# Altium schematic sheet 30-277 - DriveHUB - CV Card DCDC Module.SchDoc: IPM2 Smart Bob - 2Ch CC
size A1; Date: 08/02/22; Engineer: AJC; DocumentNumber: 34-413; Revision: A; SheetNumber: 1; SheetTotal: 1; Manager: AJC
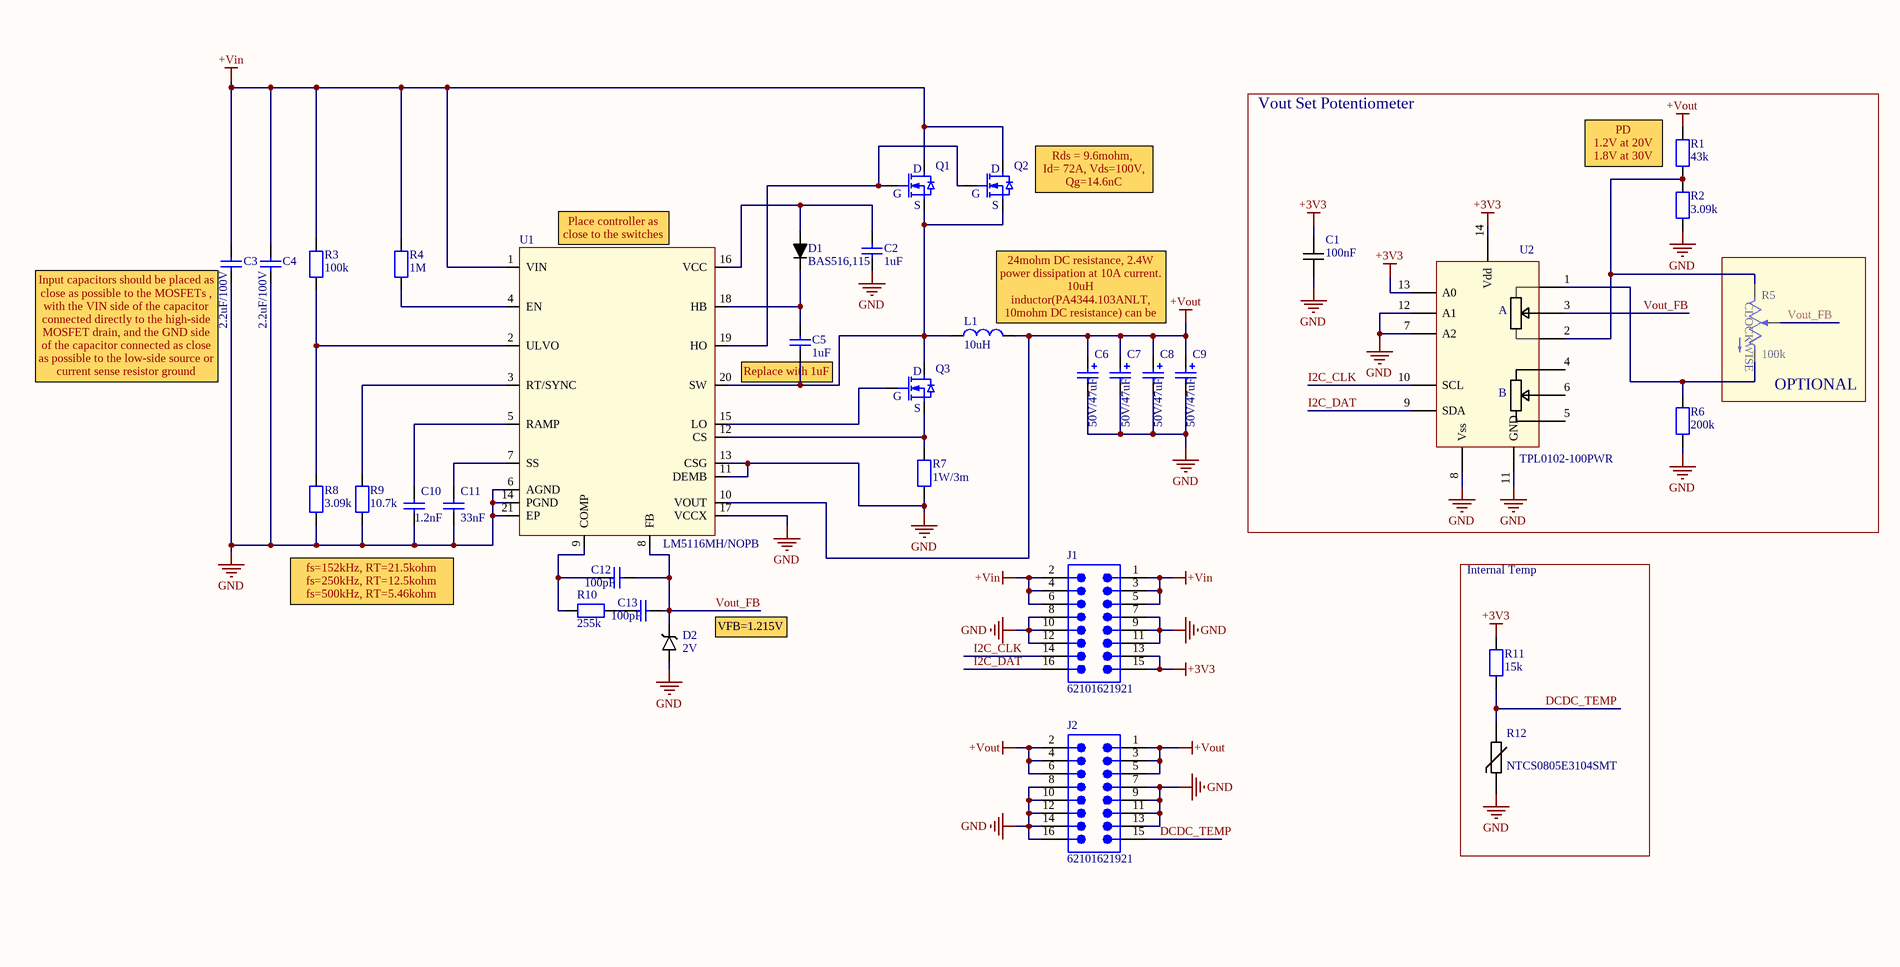
[diagram p0: 30-277 - DriveHUB - CV Card DCDC Module.SchDoc, left]
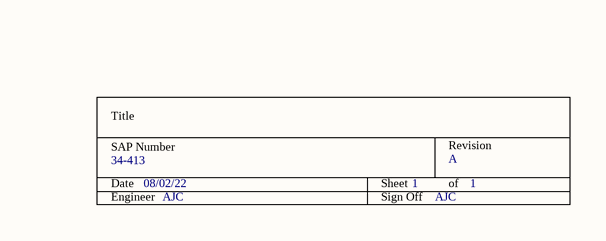
[diagram p1: 30-277 - DriveHUB - CV Card DCDC Module.SchDoc, right]

## Parts
?  Drawn By: AJC  Document Number: 34-413  Revision Number: A  Total Sheets: 1  Design Date: 08/02/22  (hidden comment: Title Block Standard_GDS)  (graphical)
C1  100nF  [SMD_C(0603)]
C2  1uF  [SMD_C(0805)]
C3  2.2uF/100V  [SMD_C(1210)]
C4  2.2uF/100V  [SMD_C(1210)]
C5  1uF  [SMD_C(0805)]
C6  50V/47uF  [CAPAE7866X54M]
C7  50V/47uF  [CAPAE7866X54M]
C8  50V/47uF  [CAPAE7866X54M]
C9  50V/47uF  [CAPAE7866X54M]
C10  1.2nF  [SMD_C(0603)]
C11  33nF  [SMD_C(0603)]
C12  100pF  [SMD_C(0603)]
C13  100pF  [SMD_C(0603)]
D1  BAS516,115  [SOD523]
D2  2V  [SOD123]
J1  62101621921  [62101621921]
J2  62101621921  [62101621921]
L1  10uH  [Ind_PA4344.223ANLT]
Q1  BSC0805LSATMA1  [TDSON-8]  (value not drawn)
Q2  BSC0805LSATMA1  [TDSON-8]  (value not drawn)
Q3  BSC0805LSATMA1  [TDSON-8]  (value not drawn)
R1  43k  [SMD_R(0603)]
R2  3.09k  [SMD_R(0603)]
R3  100k  [SMD_R(0603)]
R4  1M  [SMD_R(0603)]
R5  100k  [TRIM_3361P-1-104GLF]
R6  200k  [SMD_R(0603)]
R7  1W/3m  [SMD_R(2512)]
R8  3.09k  [SMD_R(0603)]
R9  10.7k  [SMD_R(0603)]
R10  255k  [SMD_R(0603)]
R11  15k  [SMD_R(0603)]
R12  NTCS0805E3104SMT  [SMD_R(0805)]
U1  LM5116MH/NOPB  [HTSSOP-20]
U2  TPL0102-100PWR  [SOP65P640X120-14N]

## Blocks framed on the sheet
Vout Set Potentiometer: C1 R1 R2 R6 U2
OPTIONAL: R5
Internal Temp: R11 R12

## Nets
+3V3: C1.2 J1.13 J1.15 R11.2 U2.13(A0) U2.14(Vdd)
+Vin: C3.2 C4.2 J1.1 J1.2 J1.3 J1.4 J1.5 J1.6 Q1.D Q2.D R3.2 R4.2 U1.1(VIN)
+Vout: C6.1 C7.1 C8.1 C9.1 J2.1 J2.2 J2.3 J2.4 J2.5 J2.6 L1.2 R1.2 U1.10(VOUT)
GND: C1.1 C2.1 C3.1 C4.1 C6.2 C7.2 C8.2 C9.2 C10.1 C11.1 D2.A J1.7 J1.8 J1.9 J1.10 J1.11 J1.12 J2.7 J2.8 J2.9 J2.10 J2.11 J2.12 J2.13 J2.14 J2.16 R2.1 R6.1 R7.1 R8.1 R9.1 R12.2 U1.6(AGND) U1.11(DEMB) U1.13(CSG) U1.14(PGND) U1.17(VCCX) U1.21(EP) U2.7(A2) U2.8(Vss) U2.11(GND) U2.12(A1)
DCDC_TEMP: J2.15 R11.1 R12.1
I2C_CLK: J1.14 U2.10(SCL)
I2C_DAT: J1.16 U2.9(SDA)
Vout_FB: C12.2 C13.2 D2.C R5.2(WIPER) U1.8(FB) U2.3
NetC2_2: C2.2 D1.A U1.16(VCC)
NetC5_1: C5.1 L1.1 Q1.S Q2.S Q3.D U1.20(SW)
NetC5_2: C5.2 D1.C U1.18(HB)
NetC10_2: C10.2 U1.5(RAMP)
NetC11_2: C11.2 U1.7(SS)
NetC12_1: C12.1 R10.1 U1.9(COMP)
NetC13_1: C13.1 R10.2
NetQ1_G: Q1.G Q2.G U1.19(HO)
NetQ3_G: Q3.G U1.15(LO)
NetQ3_S: Q3.S R7.2 U1.12(CS)
NetR1_1: R1.1 R2.2 R5.1(CCW) U2.2
NetR3_1: R3.1 R8.2 U1.2(ULVO)
NetR4_1: R4.1 U1.4(EN)
NetR5_3: R5.3(CW) R6.2 U2.1
NetR9_2: R9.2 U1.3(RT/SYNC)

Not connected (* = marked no-connect by the designer): U2 4 5 6

## Notes on the sheet
- PD
  1.2V at 20V
  1.8V at 30V
- (near U1) Place controller as close to the switches
- (near Q2) Rds = 9.6mohm,
  Id= 72A, Vds=100V,
  Qg=14.6nC
- (near C3) Input capacitors should be placed as close as possible to the MOSFETs , with the VIN side of the capacitor connected directly to the high-side MOSFET drain, and the GND side of the capacitor connected as close as possible to the low-side source or current sense resistor ground connection.
- (near C5) Replace with 1uF
- (near L1) 24mohm DC resistance, 2.4W power dissipation at 10A current.
  10uH inductor(PA4344.103ANLT, 10mohm DC resistance) can be used at 500kHz fsw
- fs=152kHz, RT=21.5kohm
  fs=250kHz, RT=12.5kohm
  fs=500kHz, RT=5.46kohm
- VFB=1.215V
- (in symbol 3361P-1-104GLF) CLOCKWISE
- (in symbol Title Block Standard_GDS) Title; SAP Number; Revision; Date; Sheet; of; Engineer; Sign Off
- (in symbol TPL0102-100RUCR) A; B

## Library data of the parts
C1 = 100nF 50V 0603 X7R: Manufacturer: Yageo; Manufacturer Part Number: CC0603KRX7R9BB104; Value: 100nF; Supplier: mouser; Supplier Part Number: 603-CC603KRX7R9BB104
C2 C5 = 1uF ±10% 50V: Manufacturer: Yageo; Manufacturer Part Number: CC0805KKX5R9BB105; Value: 1uF; Supplier: mouser; Supplier Part Number: 603-CC0805KKX5R9BB105; Price: 0.26
C3 C4 = C1210C225K1RACTU: 2.2 uF ± 10% 100V; Manufacturer: KEMET; Value: 2.2uF/100V; Manufacturer Part Number: C1210C225K1RACTU; Supplier: mouser; Supplier Part Number: 80-C1210C225K1R; Price: 0.96
C6-C9 = EMZR500ARA470MF61G: Aluminium Electrolytic Capacitors - SMD 50V 47uF 2000Hrs 20% ESR=680mOhms; Manufacturer: United Chemi-Con; Manufacturer Part Number: EMZR500ARA470MF61G; Supplier: mouser; Supplier Part Number: 661-EMZR500ARA470MF6; Value: 50V/47uF
C10 = 1.2nF ± 5% 50V: Manufacturer: Yageo; Manufacturer Part Number: CC0603JRX7R9BB122; Value: 1.2nF; Supplier: mouser; Supplier Part Number: 603-CC0603JRX7R9BB122
C11 = 33nF ± 10% 50V: Manufacturer: Yageo; Manufacturer Part Number: CC0603JRX7R9BB333; Value: 33nF; Supplier: mouser; Supplier Part Number: 603-CC0603JRX7R9BB333
C12 C13 = 100pF ± 5% 50V: Manufacturer: Yageo; Manufacturer Part Number: CC0603JRNPO9BN101; Value: 100pF; Supplier: mouser; Supplier Part Number: 603-CC0603JRNPO9BN101; Price: 0.1
D1 = BAS516,115: Diodes - General Purpose, Power, Switching; Manufacturer: Nexperia; PackageReference: BAS516,115; Manufacturer Part Number: BAS516,115; Value: BAS516,115; Supplier: mouser; Supplier Part Number: 771-BAS516-T/R
D2 = SZMMSZ4679T1G: Zener Diodes 500MW 2V; Manufacturer: onsemi; Manufacturer Part Number: SZMMSZ4679T1G; Value: 2V; Supplier: mouser; Supplier Part Number: 863-SZMMSZ4679T1G
J1 J2 = 62101621921: WR-PHD Pin Header, SMT, Vertical, pitch 2mm, 2 Row, 16P; Manufacturer: Wurth Elektronik; Contact Resistance: 20mΩ; Rated Current: 2A; Working Voltage: 200V; Withstanding Voltage: 500V; ComponentLink1Description: Website Link; ComponentLink1URL: https://www.we-online.com/redexpert/article/621316245821?ad; ComponentLink2Description: Datasheet Link; ComponentLink2URL: https://www.we-online.com/redexpert/spec/621316245821?ad; Manufacturer Part Number: 62101621921; Category: Board-to-Board Connectors; Match Code: WR-PHD; Mount: Surface Mount; Operating Temperature Max: 105°C; Operating Temperature Min: -40°C; Packaging: Tape and Reel; Gender: Pin Header; Number of Pins: 16; Number of Rows: 2; Orientation: Vertical; Pitch: 2mm; Supplier: mouser; Supplier Part Number: 710-62101621921
L1 = PA4344.103ANLT: Power Inductors - SMD 10uH 21A 7mm 20% SMT; Manufacturer: Pulse Electronics; Manufacturer Part Number: PA4344.103ANLT; Value: 10uH; Supplier: mouser; Supplier Part Number: 673-PA4344.103ANLT
Q1-Q3 = BSC0805LSATMA1: MOSFET 100V Vds 20V Vgs TDSON-8; Manufacturer: Infineon Technologies; PackageReference: BSC0805LSATMA1; Manufacturer Part Number: BSC0805LSATMA1; Supplier: mouser; Supplier Part Number: 726-BSC0805LSATMA1
R1 = 43 kOhms ±1% 0.1W: Manufacturer: Yageo; Manufacturer Part Number: RC0603FR-0743KL; Value: 43k; Supplier: mouser; Supplier Part Number: 603-RC0603FR-0743KL; Price: 0.1
R2 R8 = 3.09 kOhms ±1% 0.1W: Manufacturer: Yageo; Manufacturer Part Number: RC0603FR-073K09L; Value: 3.09k; Supplier: mouser; Supplier Part Number: 603-RC0603FR-073K09L; Price: 0.1
R3 = 100 kOhms ±1% 0.1W: Manufacturer: Yageo; Manufacturer Part Number: RC0603FR-07100KL; Value: 100k; Supplier: mouser; Supplier Part Number: 603-RC0603FR-07100KL; Price: 0.1
R4 = 1 MOhms ±1% 0.1W: Manufacturer: Yageo; Manufacturer Part Number: RC0603FR-071ML; Value: 1M; Supplier: mouser; Supplier Part Number: 603-RC0603FR-071ML; Price: 0.1
R5 = 3361P-1-104GLF: 100 kOhms 0.5W, 1/2W Gull Wing Surface Mount Trimmer Potentiometer Cermet 1.0 Turn Top Adjustment; Manufacturer: Bourns; Package: 3361P Bourns; Price: None; Availability: In Stock; Purchase-URL: https://pricing.snapeda.com/search/part/3361P-1-104GLF/?ref=eda; Check_prices: https://www.snapeda.com/parts/3361P-1-104GLF/Bourns/view-part/?ref=eda; Manufacturer Part Number: 3361P-1-104GLF; SnapEDA_Link: https://www.snapeda.com/parts/3361P-1-104GLF/Bourns/view-part/?ref=snap; Value: 100k; Supplier: mouser; Supplier Part Number: 652-3361P-1-104GLF
R6 = 200 kOhms ±1% 0.1W: Manufacturer: Yageo; Manufacturer Part Number: RC0603FR-07200KL; Value: 200k; Supplier: mouser; Supplier Part Number: 603-RC0603FR-07200KL; Price: 0.1
R7 = PA2512FKF070R003E: 3 mOhms ±1% 1W; Manufacturer: Yageo; Value: 1W/3m; Manufacturer Part Number: PA2512FKF070R003E; Supplier: mouser; Supplier Part Number: 603-PA2512FKF070R003
R9 = 10.7 kOhms ±1% 0.1W: Manufacturer: Yageo; Manufacturer Part Number: RC0603FR-0710K7L; Value: 10.7k; Supplier: mouser; Supplier Part Number: 603-RC0603FR-0710K7L; Price: 0.1
R10 = 255 kOhms ±1% 0.1W: Manufacturer: Yageo; Manufacturer Part Number: RC0603FR-07255KL; Value: 255k; Supplier: mouser; Supplier Part Number: 603-RC0603FR-07255KL; Price: 0.1
R11 = 15 kOhms ±1% 0.1W: Manufacturer: Yageo; Manufacturer Part Number: RC0603FR-0715KL; Value: 15k; Supplier: mouser; Supplier Part Number: 603-RC0603FR-0715KL; Price: 0.1
R12 = NTCS0805E3104SMT: THERM NTC 100KOHM 3590K 0805; Manufacturer: Vishay Beyschlag/Draloric/BC Components; Value: NTCS0805E3104SMT; Manufacturer Part Number: NTCS0805E3104SMT; Price: 1.16; Supplier: mouser; Supplier Part Number: 594-NTCS0805E3104SMT
U1 = LM5116MH/NOPB: Manufacturer Name: Texas Instruments; Manufacturer Part Number: LM5116MH/NOPB; Value: N/A; PackageReference: LM5116MH/NOPB; Supplier: mouser; Supplier Part Number: 926-LM5116MH/NOPB
U2 = TPL0102-100RUCR: Non Volatile Digital Potentiometer, 100 kohm, Dual, I2C, Linear, ± 20%, 2.7 V; Manufacturer: Texas Instruments; Manufacturer Part Number: TPL0102-100PWR; Price: 3; Supplier: Mouser; Supplier Part Number: 595-TPL0102-100PWR; Value: TPL0102-100PWR
? = Title Block Standard_GDS: Sheet Number: 1; Manager: AJC